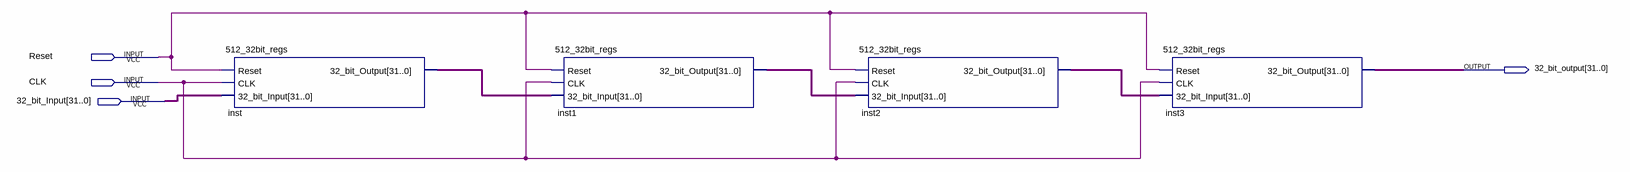
[diagram p0: schematic sheet]
// Quartus schematic 2048_32bit_regs.bdf as structural Verilog: 4 symbols, 4 pins
module \2048_32bit_regs  (
  input  Reset,
  input  CLK,
  input  [31:0] \32_bit_Input ,
  output [31:0] \32_bit_output 
);

  wire [31:0] inst1_32_bit_output, inst2_32_bit_output, inst_32_bit_output;

  \512_32bit_regs  inst (
    .Reset(Reset), .CLK(CLK), .\32_bit_Input (\32_bit_Input ), .\32_bit_Output (inst_32_bit_output));
  \512_32bit_regs  inst1 (
    .Reset(Reset), .CLK(CLK), .\32_bit_Input (inst_32_bit_output), .\32_bit_Output (inst1_32_bit_output));
  \512_32bit_regs  inst2 (
    .Reset(Reset), .CLK(CLK), .\32_bit_Input (inst1_32_bit_output), .\32_bit_Output (inst2_32_bit_output));
  \512_32bit_regs  inst3 (
    .Reset(Reset), .CLK(CLK), .\32_bit_Input (inst2_32_bit_output), .\32_bit_Output (\32_bit_output ));
endmodule
